# EAGLE design SOL_ZSAT_lora (EAGLE 9.0.0)
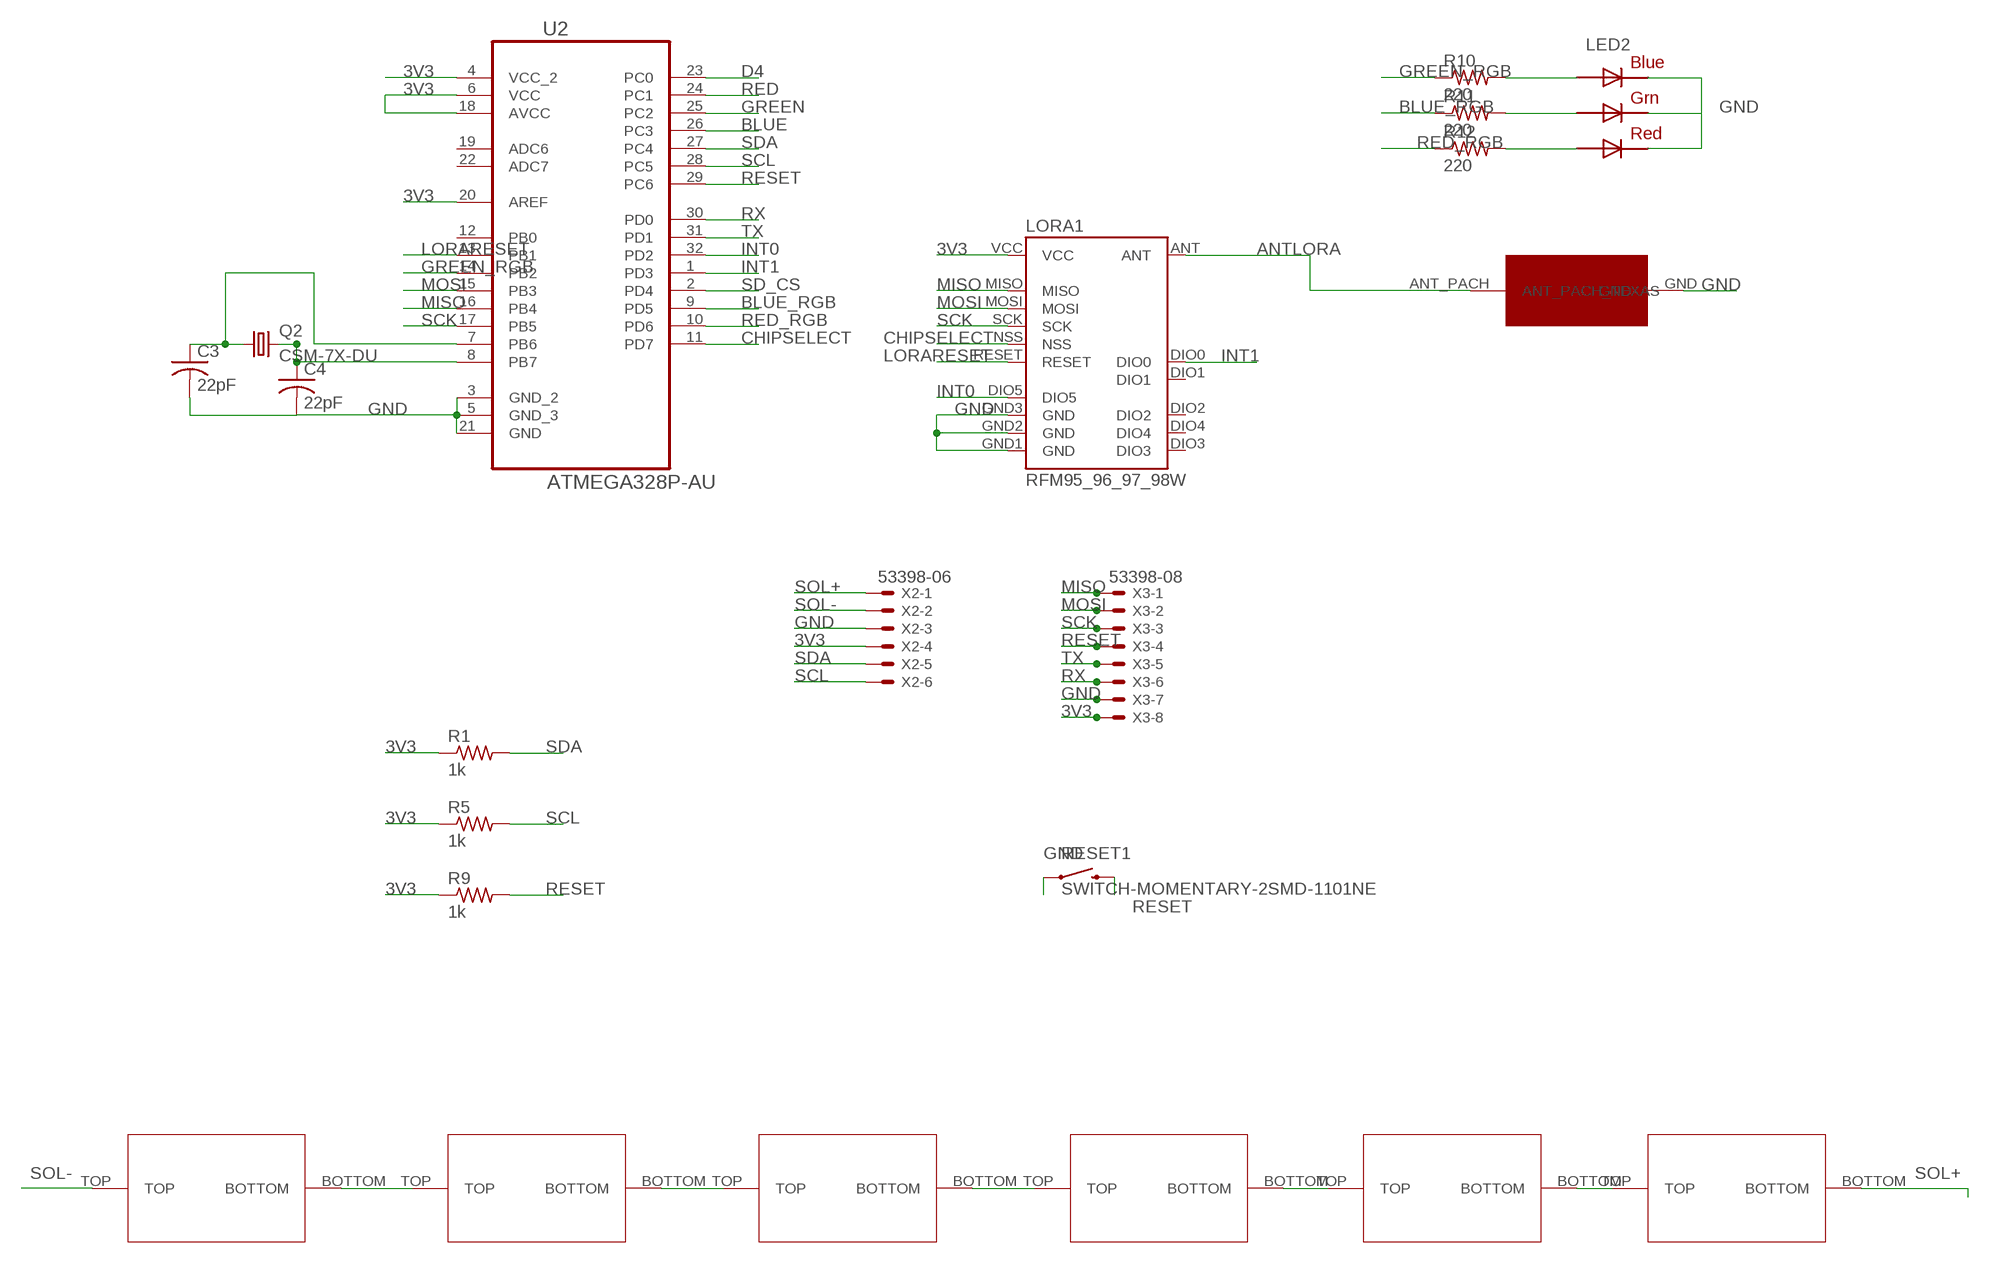
[diagram p0: schematic, sheet 1]

## Parts
C3  22pF  C-USC0603  [C0603]
C4  22pF  C-USC0603  [C0603]
LED2  RGBLED5050  [RGBLED5050]
LORA1  RFM95_96_97_98W  [RFM95_96_97_98W]
Q2  CSM-7X-DU  [CSM-7X-DU]
R1  1k  R-US_M1206  [M1206]
R5  1k  R-US_M1206  [M1206]
R9  1k  R-US_M1206  [M1206]
R10  220  R-US_R0603  [R0603]
R11  220  R-US_R0603  [R0603]
R12  220  R-US_R0603  [R0603]
RESET1  SWITCH-MOMENTARY-2SMD-1101NE  [TACTILE-SWITCH-1101NE]
U2  ATMEGA328P-AU  [QFP80P900X900X120-32N]
U$1  SOL_26X52  [SOLAR_52X26]
U$2  SOL_26X52  [SOLAR_52X26]
U$3  SOL_26X52  [SOLAR_52X26]
U$4  SOL_26X52  [SOLAR_52X26]
U$5  SOL_26X52  [SOLAR_52X26]
U$6  SOL_26X52  [SOLAR_52X26]
U$7  915MHZ_PACH_TEXAS  [915MHZ_PACH_TEXAS]
X2  53398-06  [53398-06]
X3  53398-08  [53398-08]

## Nets
3V3: LORA1.VCC R1.1 R5.1 R9.1 U2.4(VCC_2) U2.6(VCC) U2.18(AVCC) U2.20(AREF) X2.4 X3.8
ANTLORA: LORA1.ANT U$7.ANT_PACH(ANT_PACH_TEXAS)
BLUE: U2.26(PC3)
BLUE_RGB: R11.1 U2.9(PD5)
CHIPSELECT: LORA1.NSS U2.11(PD7)
D4: U2.23(PC0)
GND: C3.2 C4.2 LED2.4(BLUE_C) LED2.5(RED_C) LED2.6(GREEN_C) LORA1.GND1(GND) LORA1.GND2(GND) LORA1.GND3(GND) RESET1.1 U2.3(GND_2) U2.5(GND_3) U2.21(GND) U$7.GND X2.3 X3.7
GREEN: U2.25(PC2)
GREEN_RGB: R10.1 U2.14(PB2)
INT0: LORA1.DIO5 U2.32(PD2)
INT1: LORA1.DIO0 U2.1(PD3)
LORARESET: LORA1.RESET U2.13(PB1)
MISO: LORA1.MISO U2.16(PB4) X3.1
MOSI: LORA1.MOSI U2.15(PB3) X3.2
N$2: U$1.BOTTOM U$2.TOP
N$3: U$2.BOTTOM U$3.TOP
N$4: U$3.BOTTOM U$4.TOP
N$5: U$4.BOTTOM U$5.TOP
N$6: U$5.BOTTOM U$6.TOP
N$10: C4.1 Q2.2 U2.8(PB7)
N$11: C3.1 Q2.1 U2.7(PB6)
N$12: LED2.3(BLUE_A) R10.2
N$13: LED2.1(GREEN_A) R11.2
N$14: LED2.2(RED_A) R12.2
RED: U2.24(PC1)
RED_RGB: R12.1 U2.10(PD6)
RESET: R9.2 RESET1.2 U2.29(PC6) X3.4
RX: U2.30(PD0) X3.6
SCK: LORA1.SCK U2.17(PB5) X3.3
SCL: R5.2 U2.28(PC5) X2.6
SD_CS: U2.2(PD4)
SDA: R1.2 U2.27(PC4) X2.5
SOL+: U$6.BOTTOM X2.1
SOL-: U$1.TOP X2.2
TX: U2.31(PD1) X3.5
Unconnected: LORA1.DIO1 LORA1.DIO2 LORA1.DIO3 LORA1.DIO4 U2.12(PB0) U2.19(ADC6) U2.22(ADC7)

## Library data of the parts
C3 C4 = rcl:C-US: CAPACITOR, American symbol
LED2 = adafruit:RGBLED: For 5050 RGB LEDs, the order of the LEDs may vary from one manufacturer to another!
LORA1 = Ava:RFM95_96_97_98W
Q2 = crystal:CSM-7X-DU: SMD CRYSTAL Source: www.ecsxtal.com .. Crystal 3.6864MHz CSM_7X_DU.PDF; OC_FARNELL: unknown; OC_NEWARK: unknown
R1 R5 R9-R12 = adafruit:R-US_: RESISTOR, American symbol
RESET1 = SparkFun-Electromechanical:SWITCH-MOMENTARY-2: Various NO switches- pushbuttons, reed, etc; PROD_ID: SWCH-00815
U2 = Atmel_By_element14_Batch_1-00:ATMEGA328P-AU: 8-bit Microcontroller with In-System Programmable Flash; MPN: ATMEGA328P-AU; OC_FARNELL: 1715486; OC_NEWARK: 14R4631; PACKAGE: TQFP-32; SUPPLIER: Atmel
U$1-U$6 = sil_26x52:SOL_26X52
U$7 = ant_pach_915:915MHZ_PACH_TEXAS
X2 = con-molex:53?-06: CONNECTOR wire to board 1.25 mm (.049 inch) pitch header; MF: MOLEX; OC_FARNELL: 1125368; OC_NEWARK: unknown
X3 = con-molex:53?-08: CONNECTOR wire to board 1.25 mm (.049 inch) pitch header; MF: MOLEX; OC_FARNELL: 1125371; OC_NEWARK: unknown

## Board
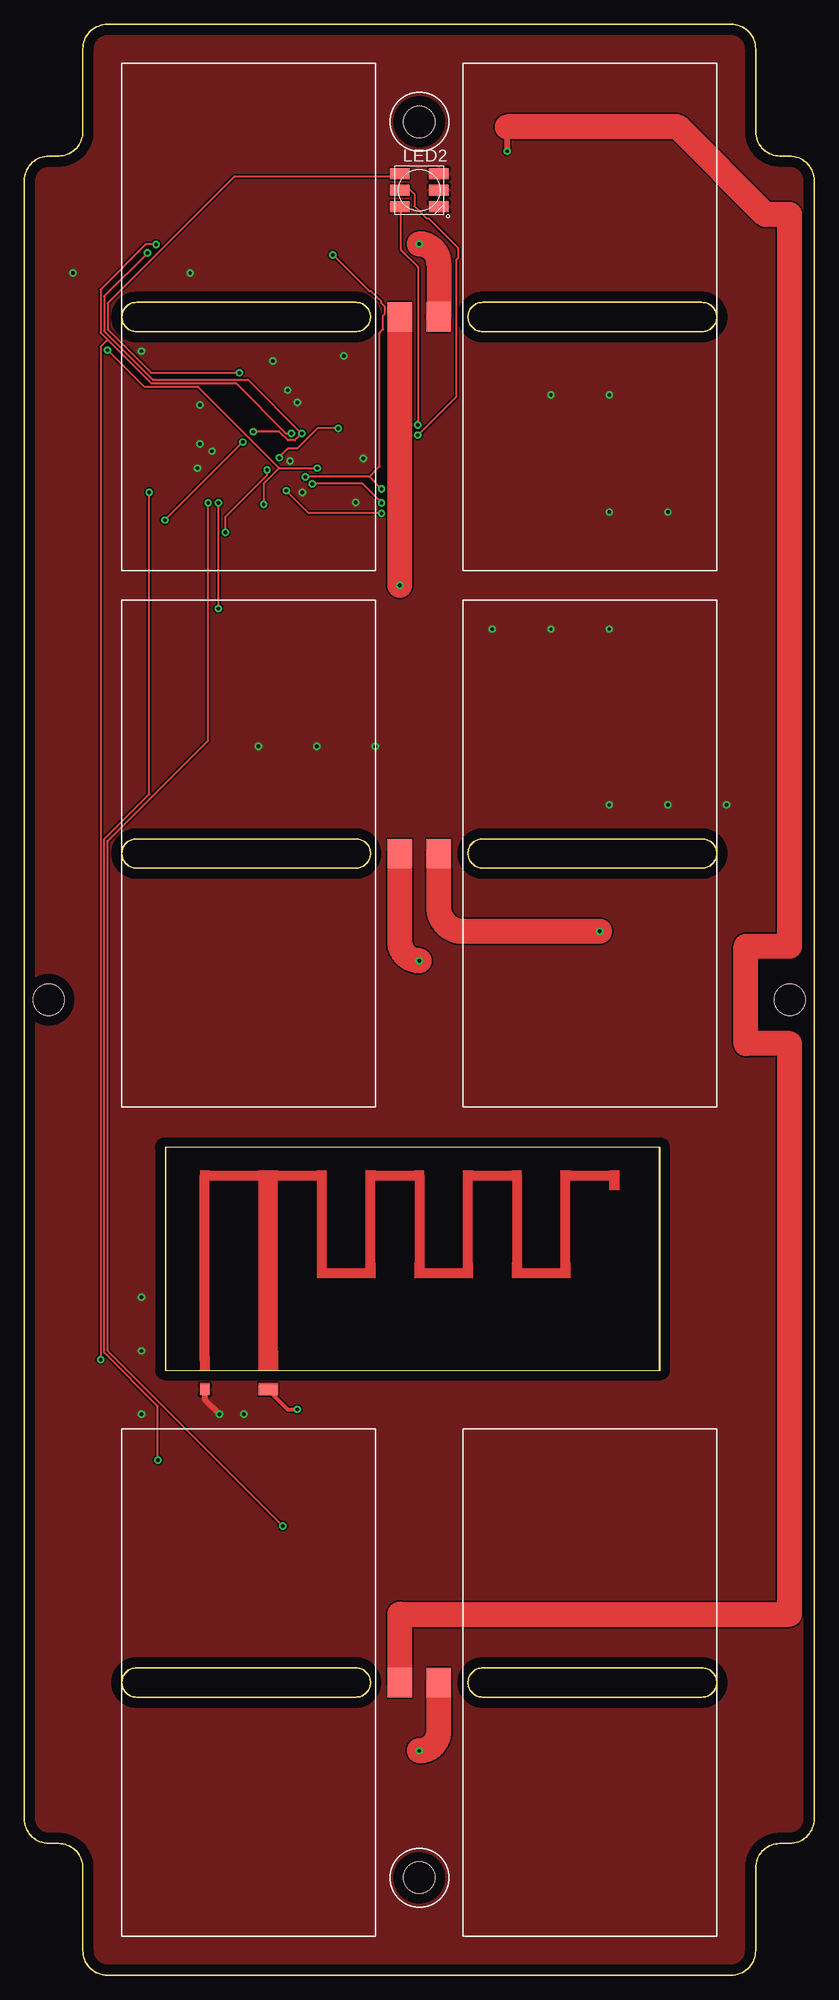
[diagram p1: board, top side]
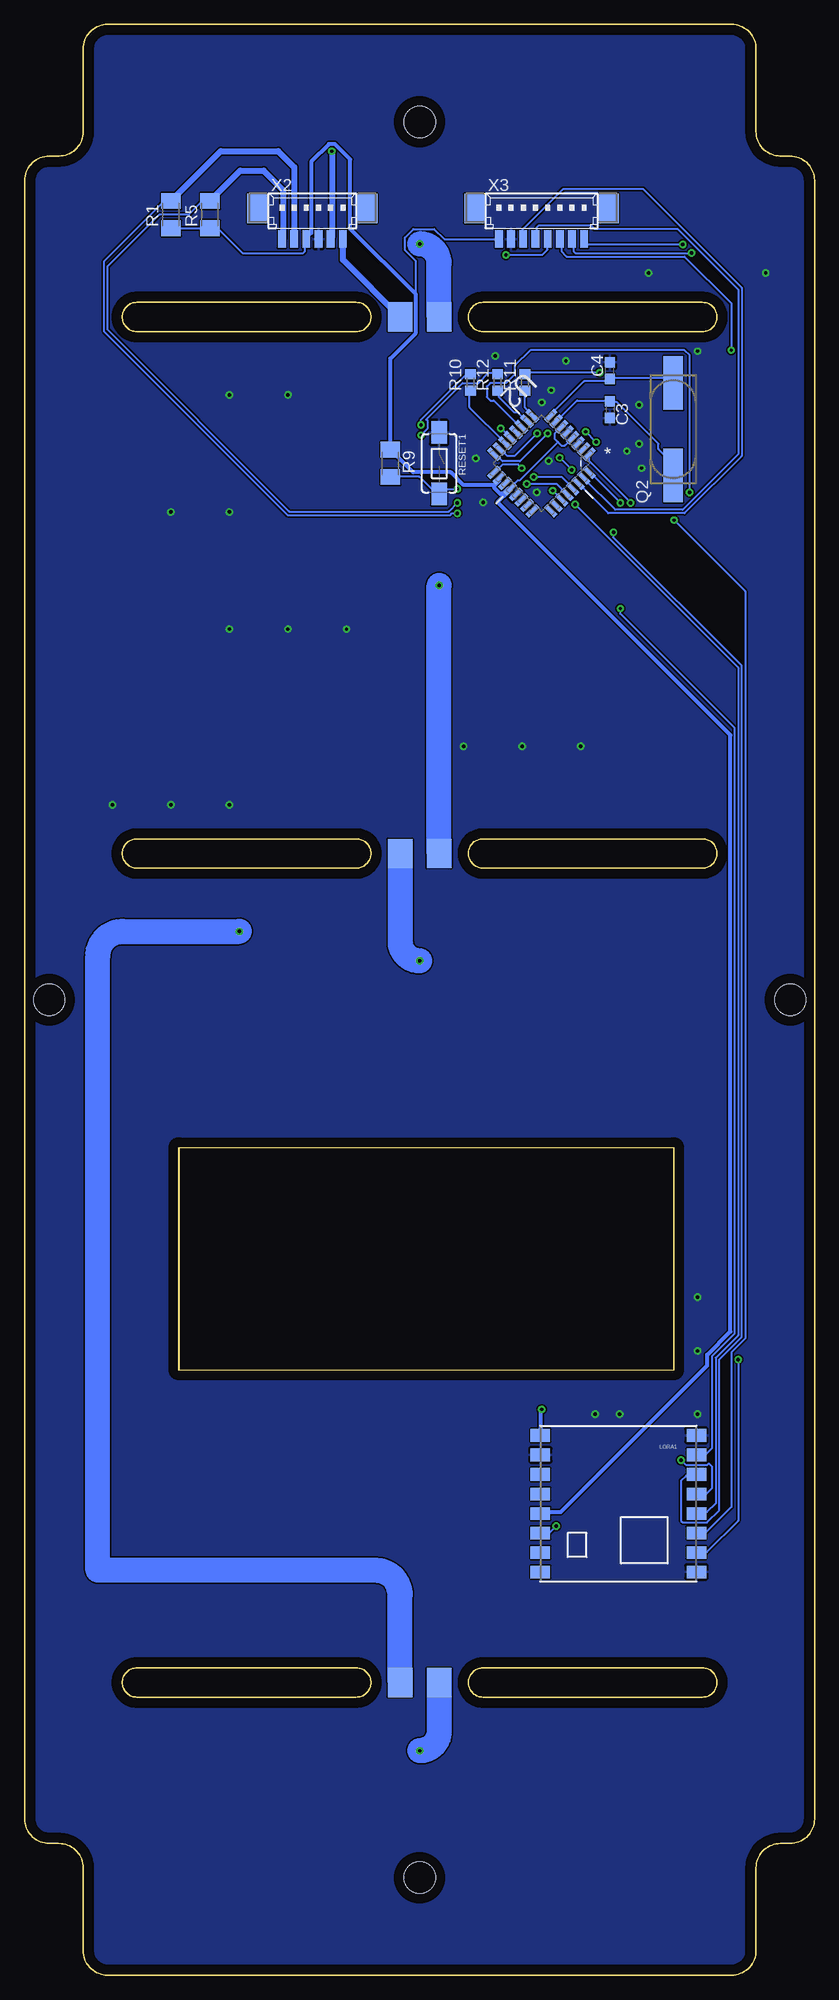
[diagram p2: board, bottom side, seen from below]

Size 81 x 200 mm. Coordinates in mm from the lower left corner, seen from the top.
Outline: 6,11 6,2.5 arc90 8.5,0 72.5,0 arc90 75,2.5 75,11 arc-90 77.5,13.5 78.5,13.5 arc90 81,16 81,184 arc90 78.5,186.5 77.5,186.5 arc-90 75,189 75,197.5 arc90 72.5,200 8.5,200 arc90 6,197.5 6,189 arc-90 3.5,186.5 2.5,186.5 arc90 0,184 0,16 arc90 2.5,13.5 3.5,13.5 arc-90 6,11
Copper layers (1*16): Top 0.035mm / dielectric 1.5mm / Bottom 0.035mm
Design rules "default *": minimum track width 8mil, minimum drill 0.35mm, track to track 6mil, track to pad 6mil, pad to pad 6mil, via to via 6mil, smd to smd 6mil, copper to edge 40mil, drill to drill 6mil, minimum pad ring 10mil, minimum via ring 8mil, stop-mask expansion 4000mil, vias tented up to drill 30mil, thermal gap 10mil
Holes 3.2 mm at 2.5,100 78.5,100 40.5,10 40.5,190

### Footprints (pad centres in the part's own frame; a part is rotated, then mirrored left to right if it is on the bottom)
C0603 = smd 1.1 x 1: 1 -0.85,0; 2 0.85,0
RGBLED5050 = smd 2 x 1.1: 1 -2,1.7; 2 -2,0; 3 -2,-1.7; 4 2,-1.7; 5 2,0; 6 2,1.7
RFM95_96_97_98W = smd 2 x 1.3: ANT 8,-7; DIO0 8,3; DIO1 8,5; DIO2 8,7; DIO3 8,-3; DIO4 8,-1; DIO5 -8,-5; GND1 -8,7; GND2 8,-5; GND3 -8,-7; MISO -8,5; MOSI -8,3; NSS -8,-1; RESET -8,-3; SCK -8,1; VCC 8,1
CSM-7X-DU = smd 5.5 x 2: 1 -4.75,0; 2 4.75,0
M1206 = smd 1.6 x 2: 1 -1.4,0; 2 1.4,0
R0603 = smd 1 x 1.1: 1 -0.85,0; 2 0.85,0
TACTILE-SWITCH-1101NE = smd 2.3 x 1.6: 1 -3.15,0; 2 3.15,0
QFP80P900X900X120-32N = smd 1.473 x 0.508: 1 -4.115,2.794; 2 -4.115,2.007; 3 -4.115,1.194; 4 -4.115,0.406; 5 -4.115,-0.406; 6 -4.115,-1.194; 7 -4.115,-2.007; 8 -4.115,-2.794; 17 4.115,-2.794; 18 4.115,-2.007; 19 4.115,-1.194; 20 4.115,-0.406; 21 4.115,0.406; 22 4.115,1.194; 23 4.115,2.007; 24 4.115,2.794 | smd 0.508 x 1.473: 9 -2.794,-4.115; 10 -2.007,-4.115; 11 -1.194,-4.115; 12 -0.406,-4.115; 13 0.406,-4.115; 14 1.194,-4.115; 15 2.007,-4.115; 16 2.794,-4.115; 25 2.794,4.115; 26 2.007,4.115; 27 1.194,4.115; 28 0.406,4.115; 29 -0.406,4.115; 30 -1.194,4.115; 31 -2.007,4.115; 32 -2.794,4.115
SOLAR_52X26 = smd 3 x 2.5 bottom: BOTTOM 0,28.5 | smd 3 x 2.5: TOP 0,28.5
915MHZ_PACH_TEXAS = smd 2 x 1: ANT_PACH 5.5,-2 | smd 1 x 1: GND -1,-2
53398-06 = smd 0.8 x 1.8: 1 3.125,-2.5; 2 1.875,-2.5; 3 0.625,-2.5; 4 -0.625,-2.5; 5 -1.875,-2.5; 6 -3.125,-2.5 | smd 2.1 x 3: S1 5.625,0.625; S2 -5.625,0.625
53398-08 = smd 0.8 x 1.8: 1 4.375,-2.5; 2 3.125,-2.5; 3 1.875,-2.5; 4 0.625,-2.5; 5 -0.625,-2.5; 6 -1.875,-2.5; 7 -3.125,-2.5; 8 -4.375,-2.5 | smd 2.1 x 3: S1 6.875,0.625; S2 -6.875,0.625

### Placement (x,y rotation side)
C3  21,160.5 270 bottom
C4  21,164.5 90 bottom
LED2  40.5,183 0 top
LORA1  20.12,48.33 180 bottom
Q2  14.5,158.5 90 bottom
R1  66,180.5 90 bottom
R5  62,180.5 90 bottom
R9  43.5,155 270 bottom
R10  35.3,163.3 90 bottom
R11  29.7,163.3 90 bottom
R12  32.5,163.3 90 bottom
RESET1  38.5,155 270 bottom
U2  28,155 225 bottom
U$1  10,30 270 top
U$2  71,30 90 top
U$3  71,115 90 top
U$4  10,115 270 top
U$5  10,170 270 top
U$6  71,170 90 top
U$7  19.5,62 0 top
X2  51.5,180.5 0 bottom
X3  28,180.5 0 bottom

### Tracks (layer width: path | path; a pad name or v marks a point on that pad's centre or on a via)
3V3
  Bottom 0.203: R1.1 65.96,179.04 62.05,179.04 R5.1 61.87,179.04 61.16,179.04 58.67,176.56 52.45,176.56 52.27,176.73 52.27,177.98 X2.4 52.09,178.16 | 43.38,157 43.38,156.46 R9.1 | X3.8 32.36,177.98 37.98,177.98 39.02,179.02 41.13,179.02 42.02,178.13 42.02,176.87 40.89,175.74 40.89,172.32 | 26.31,157.18 26.67,157.53 26.67,158.06 25.96,158.78 U2.6 | 26.31,157.18 25.96,156.82 25.6,156.82 24.89,157.53 U2.4 | 31.29,152.38 U2.20 31.11,152.55 30.4,153.26 30.23,153.26 26.31,157.18 | 32.36,153.44 U2.18 | LORA1.VCC 28.09,47.47
  Bottom 0.406: 28.09,47.47 26.03,47.47 11,62.5 11,63.61 8.64,65.97 8.64,127.14 32.5,151 31.29,152.21 31.29,152.38 | 32.77,152.78 32.81,152.74 32.81,152.45 32.24,151.88 31.95,151.88 31.45,152.38 U2.20 | 32.77,152.78 32.36,153.19 32.36,153.44 | 32.77,152.78 35.99,152.78 37.29,154.08 41.18,154.08 R9.1 43.5,165.75 40.89,168.35 40.89,172.32 47.62,179.05 47.62,186.16 49.2,187.73 49.8,187.73 51.63,185.91 51.63,178.62 52.27,177.98
ANTLORA  (via drill 0.35)
  Top 0.406: U$7.ANT_PACH 27,58 v28,58
  Bottom 0.406: v28,58 28.12,57.88 LORA1.ANT
BLUE_RGB
  Bottom 0.203: R11.1 29.69,162.33 29.69,160.73 28.98,160.02 U2.9
CHIPSELECT  (via drill 0.35)
  Top 0.203: v12.8,152.02 12.8,121.08 8.18,116.46 8.18,63.83 13.69,58.32 v13.69,52.81
  Bottom 0.203: v12.8,152.02 12.8,166.06 13.34,166.6 29.16,166.6 30.76,165 30.76,164.11 31.65,163.22 33.25,163.22 33.6,162.87 33.6,161.8 33.25,161.44 32.89,161.44 30.23,158.78 U2.11 | v13.69,52.81 13.16,52.27 11.02,52.27 10.85,52.45 10.49,52.09 10.49,49.96 11.2,49.25 12.09,49.25 LORA1.NSS
GND  (via drill 0.35)
  Top 0.61: U$7.GND 18.5,59 v20,57.5
  other vias: 5,174.5 17,174.5 25.5,165.5 12,166.5 12,57.5 12,64 12,69.5 22.5,57.5 18,157 18,161 27.25,155.25 34,151 34.75,155.5 28.5,152 27,162.5 28,161.25 32.75,166 19.25,156.25 17.75,154.5 54,138 54,162 60,162 60,150 66,150 48,138 60,138 66,120 60,120 72,120 24,126 30,126 36,126
  pour Top: 2.5,13.5 3.5,13.5 arc-90 6,11 6,2 arc90 8,0 72.5,0 arc90 75,2 75,11 arc-90 77.5,13.5 78.5,13.5 arc90 81,16 81,184 arc90 78.5,186.5 77.5,186.5 arc-90 75,189 75,197.5 arc90 72.5,200 8.5,200 arc90 6,197.5 6,189 arc-90 3.5,186.5 2.5,186.5 arc90 0,184 0,16 arc90
  pour Bottom: 0,16 arc90 2.5,13.5 3,13.5 3.5,13.5 arc-90 6,11 6,2 arc90 8,0 10,0 72.5,0 arc90 75,2.5 75,11 arc-90 77.5,13.5 78.5,13.5 arc90 81,16 81,184 arc90 78.5,186.5 78,186.5 77.5,186.5 arc-90 75,189 75,197.5 arc90 72.5,200 72,200 8.5,200 arc90 6,197.5 6,189 arc-90 3.5,186.5 2.5,186.5 arc90 0,184
GREEN_RGB
  Bottom 0.203: R10.1 35.38,162.33 35.38,160.73 31.83,157.18 U2.14
INT0  (via drill 0.35)
  Top 0.203: v19.91,140.11 v19.91,150.95
  Bottom 0.203: v19.91,150.95 22.58,153.62 22.76,153.62 23.11,153.97 U2.32 | v19.91,140.11 19.91,139.57 8.18,127.84 8.18,65.79 10.49,63.48 10.49,54.05 11.2,53.34 12.09,53.34 LORA1.DIO5
INT1  (via drill 0.35)
  Top 0.203: v18.85,150.95 18.85,126.59 8.53,116.28 8.53,64.01 v26.49,46.05
  Bottom 0.203: v18.85,150.95 23.11,155.22 U2.1 | v26.49,46.05 27.2,45.34 28.09,45.34 LORA1.DIO0
LORARESET  (via drill 0.35)
  Top 0.203: v32.18,158.6 30.05,158.6 27.95,156.5 27,156.5 26.14,155.64 v26.14,155.57 | v24.89,154.33 24.89,153.8 20.62,149.53 v20.62,147.93
  Bottom 0.203: v32.18,158.6 31.29,157.71 U2.13 | v24.89,154.33 v26.14,155.57 | v20.62,147.93 20.62,147.4 7.47,134.24 7.47,65.43 9.78,63.12 9.78,47.65 11.02,46.41 13.51,46.41 13.69,46.58 13.69,50.67 13.16,51.21 12.27,51.21 LORA1.RESET
MISO  (via drill 0.35)
  Top 0.203: v27.38,158.06 26.85,158.06 21.69,163.22 12.98,163.22 8.53,167.66 | 8.53,167.66 7.82,168.38 7.82,172.82 12.45,177.44 v13.51,177.44 | v7.82,63.12 7.82,166.95 8.53,167.66
  Bottom 0.203: v27.38,158.06 30.23,155.22 32,155.22 32.72,155.93 U2.16 | v13.51,177.44 23.29,177.44 23.47,177.62 23.47,177.98 X3.1 | v7.82,63.12 7.82,46.58 11.02,43.38 12.09,43.38 LORA1.MISO
MOSI  (via drill 0.35)
  Top 0.203: v12.62,176.56 8.18,172.11 8.18,168.55 13.16,163.58 22.94,163.58 v28.45,158.06 27.74,157.35 27.03,157.35 26.14,158.24 v23.47,158.24 | v22.4,157.18 v14.4,149.17
  Bottom 0.203: v28.45,158.06 30.76,155.75 31.47,155.75 32.18,156.46 U2.15 | v12.62,176.56 24.54,176.56 24.71,176.73 24.71,177.98 X3.2 | v14.4,149.17 7.11,141.88 7.11,65.25 8.53,63.83 8.53,48.01 11.2,45.34 12.09,45.34 LORA1.MOSI | v23.47,158.24 v22.4,157.18
N$2  (via drill 0.35)
  Top 2.54: v40.5,23 arc90 42.5,25 U$2.TOP
  Bottom 2.54: U$1.BOTTOM 38.5,25 arc90 v40.5,23
N$3  (via drill 0.35)
  Top 2.54: v59,107 45,107 arc-90 42.5,109.5 U$3.TOP
  Bottom 2.54: U$2.BOTTOM 42.5,39 arc-90 45,41.5 73.5,41.5 73.5,104.5 arc90 71,107 v59,107
N$4  (via drill 0.35)
  Top 2.54: v40.5,104 arc-90 38.5,106 U$4.TOP
  Bottom 2.54: U$3.BOTTOM 42.5,106 arc-90 v40.5,104
N$5  (via drill 0.35)
  Top 2.54: v38.5,142.5 U$5.TOP
  Bottom 2.54: U$4.BOTTOM v38.5,142.5
N$6  (via drill 0.35)
  Top 2.54: v40.5,177.5 arc-90 42.5,175.5 U$6.TOP
  Bottom 2.54: U$5.BOTTOM 38.5,175.5 arc-90 v40.5,177.5
N$10
  Bottom 0.203: Q2.2 14.58,163.4 14.94,163.75 20.98,163.75 C4.1 21.16,163.58 21.34,163.4 23.65,163.4 27.03,160.02 U2.8
N$11
  Bottom 0.203: U2.7 26.49,159.31 24.36,161.44 21.16,161.44 C3.1 20.98,161.26 20.27,161.26 16,157 16,156.46 14.58,155.04 14.58,153.8 Q2.1
N$12  (via drill 0.35)
  Top 0.203: v40.36,158.95 40.36,175.13 38.58,176.91 38.58,181.18 LED2.3
  Bottom 0.203: v40.36,158.95 40.36,159.49 35.74,164.11 35.38,164.11 R10.2
N$13  (via drill 0.35)
  Top 0.203: v22.05,164.29 12.98,164.29 8.53,168.73 8.53,171.4 21.51,184.38 38.23,184.38 38.41,184.56 LED2.1
  Bottom 0.203: v22.05,164.29 29.69,164.29 R11.2
N$14  (via drill 0.35)
  Top 0.203: v40.36,157.89 44.27,161.8 44.27,175.84 44.45,176.02 44.45,177.09 41.43,180.11 41.25,180.11 40.01,181.36 40.01,182.6 39.47,183.13 38.58,183.13 LED2.2
  Bottom 0.203: v40.36,157.89 39.65,158.6 39.65,159.31 39.83,159.49 36.09,163.22 34.49,163.22 33.43,164.29 32.54,164.29 R12.2
RED_RGB
  Bottom 0.203: R12.1 32.36,162.33 32.36,161.8 30.76,160.2 30.4,160.2 29.52,159.31 U2.10
RESET  (via drill 0.35)
  Top 0.203: 35.38,153.62 v28.8,153.62 | v36.63,152.38 35.38,153.62 | v31.65,176.38 35.38,172.64 35.56,172.64 36.63,171.58 36.63,171.4 36.98,171.04 36.98,170.33 36.8,170.16 36.8,168.73 36.45,168.38 36.45,154.69 35.38,153.62
  Bottom 0.203: v28.8,153.62 25.96,153.62 24.89,152.55 U2.29 | v36.63,152.38 38.05,152.38 38.41,152.02 RESET1.2 38.58,152.02 38.94,152.02 40.54,153.62 43.38,153.62 R9.2 | v31.65,176.38 27.91,176.38 27.38,176.91 27.38,177.98 X3.4
RX
  Bottom 0.203: U2.30 24.18,152.91 21.16,149.88 13.34,149.88 7.47,155.75 7.47,173 17.6,183.13 25.78,183.13 30.05,178.87 30.05,178.16 X3.6
SCK  (via drill 0.35)
  Top 0.203: 26.14,154.51 v30.05,154.51 | 26.14,154.51 17.78,162.87 12.27,162.87 v8.53,166.6 | v24.54,150.77 24.54,152.91 26.14,154.51
  Bottom 0.203: v30.05,154.51 30.4,154.86 32,154.86 32.72,154.15 U2.17 | v8.53,166.6 8.53,171.4 13.34,176.2 25.43,176.2 25.96,176.73 25.96,177.98 X3.3 | v24.54,150.77 7.82,134.06 7.82,65.61 10.13,63.3 10.13,48.36 11.02,47.47 12.09,47.47 LORA1.SCK
SCL  (via drill 0.35)
  Top 0.203: v29.52,152.91 34.67,152.91 v36.63,150.95
  Bottom 0.203: v29.52,152.91 26.49,152.91 25.43,151.84 U2.28 | v36.63,150.95 37.52,150.06 53.87,150.06 72.54,168.73 72.54,175.13 67.21,180.47 64.19,180.47 62.94,181.71 62.23,181.71 R5.2
  Bottom 0.61: R5.2 58.9,185 56.5,185 54.5,183 54.5,178.12 X2.6
SDA  (via drill 0.35)
  Top 0.203: v26.85,152.2 29.16,149.88 v36.63,149.88
  Bottom 0.203: v26.85,152.2 25.96,151.31 U2.27 | v36.63,149.88 37.16,149.88 37.34,149.71 54.05,149.71 72.9,168.55 72.9,175.67 66.85,181.71 66.14,181.71 R1.2
  Bottom 0.61: R1.2 60.9,187 55,187 53.38,185.38 X2.5
SOL+
  Bottom 0.61: U$6.BOTTOM 48.38,175.88 X2.1
SOL-  (via drill 0.35)
  Top 0.61: 49.5,189.5 v49.5,187
  Top 2.54: U$1.TOP 38.5,37 78.5,37 78.5,95.5 74,95.5 74,105.5 78.5,105.5 78.5,180.5 76,180.5 67,189.5 49.5,189.5
  Bottom 0.61: v49.5,187 49.5,178.12 X2.2
TX
  Bottom 0.203: U2.31 23.65,153.44 20.45,150.24 13.51,150.24 7.82,155.93 7.82,172.82 14.05,179.04 22.58,179.04 22.94,179.4 28.27,179.4 28.45,179.22 28.45,178.16 X3.5